# Altium schematic sheet Copy of DAP-Peripherals-4.SchDoc
size C; SheetNumber: 4; SheetTotal: 4
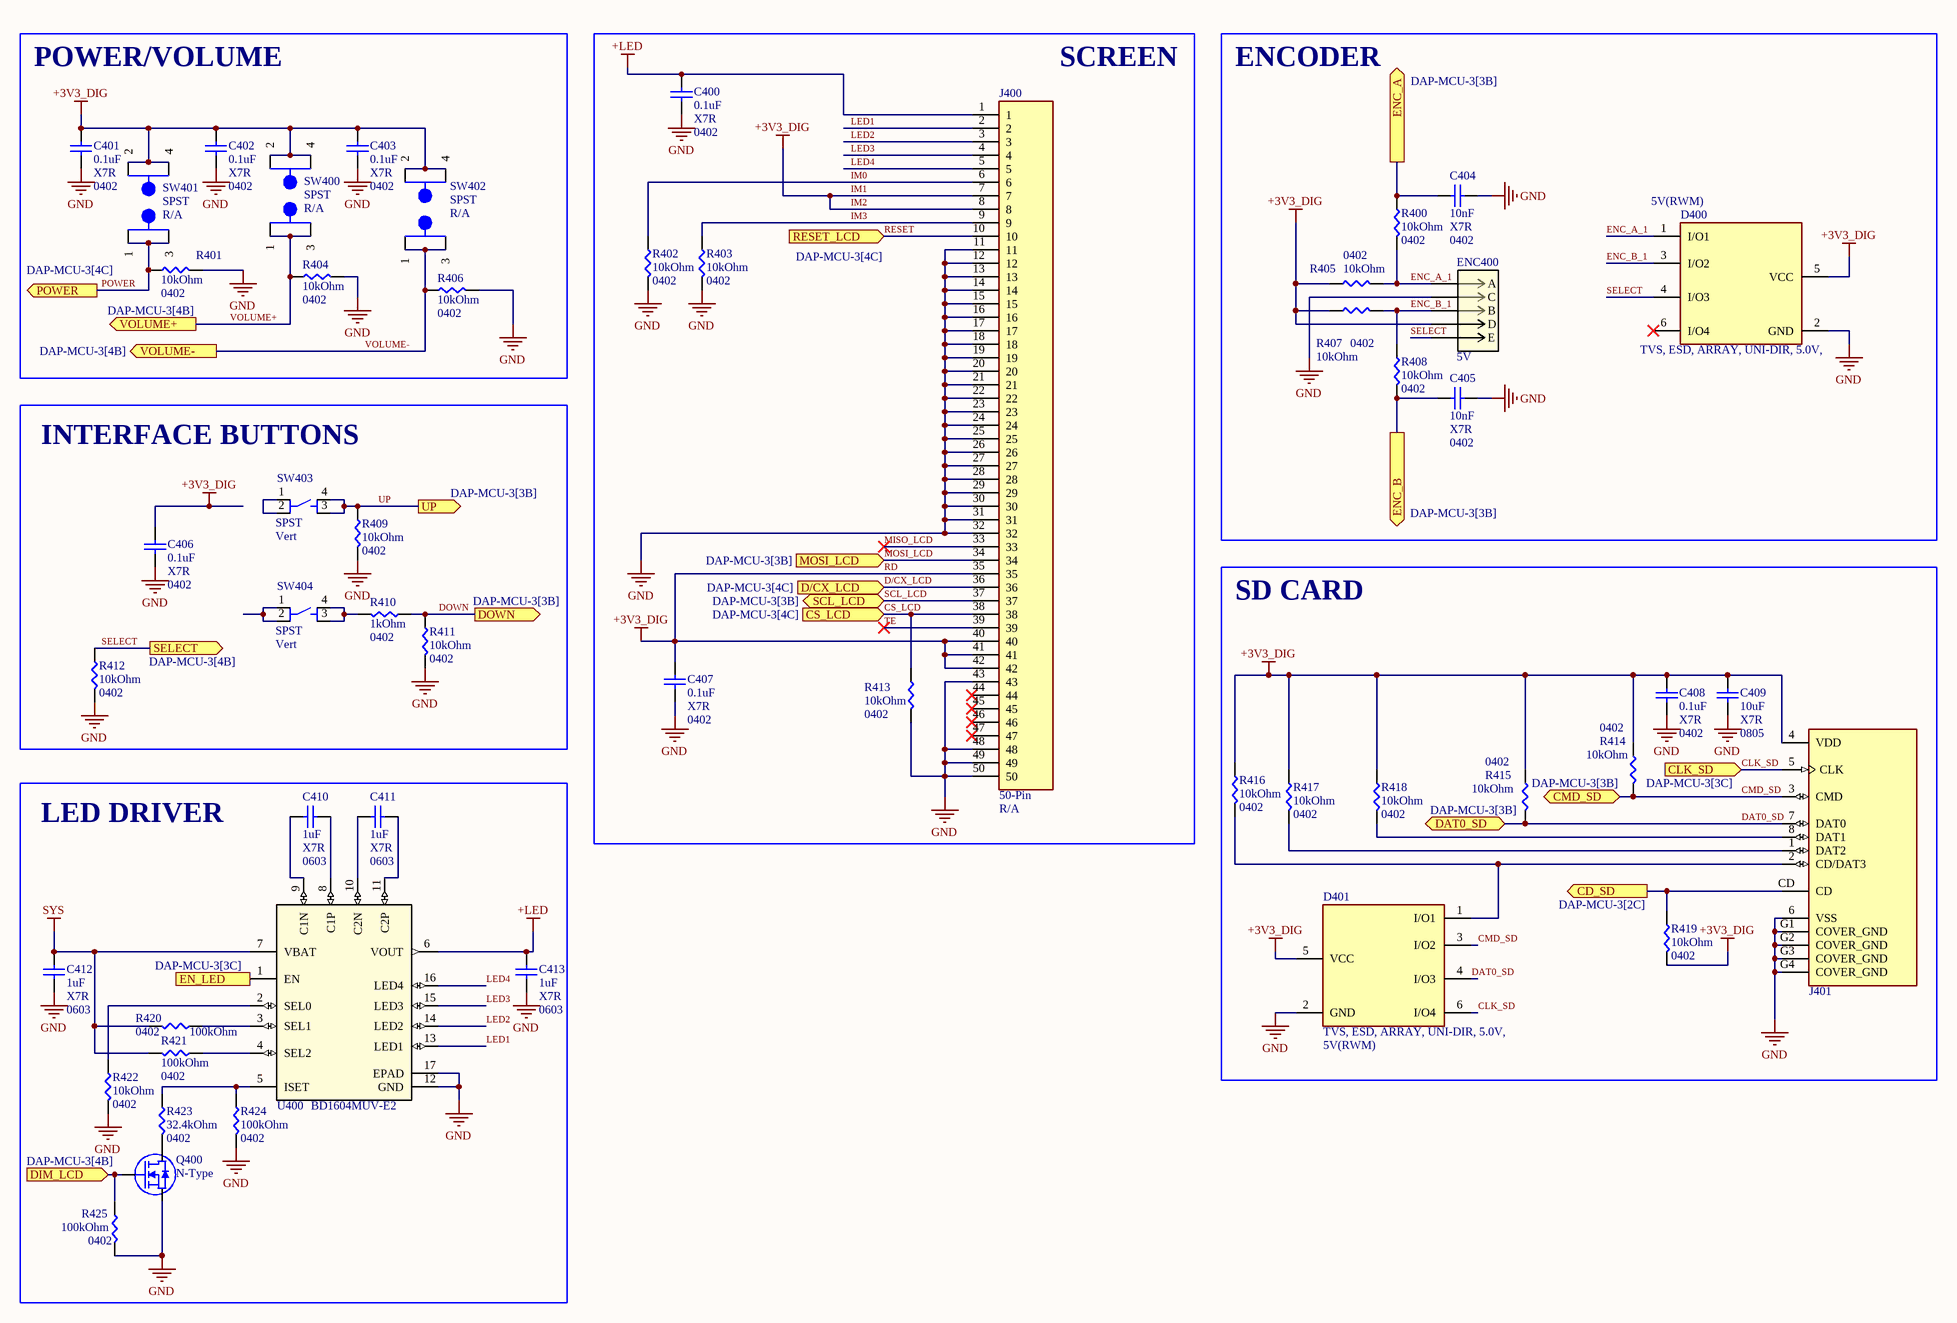
[diagram p0: Copy of DAP-Peripherals-4.SchDoc]

## Parts
C400  <Value>: 0.1uF  <Spec>: X7R  <Footprint>: 0402  [CAPC1005X60N]  (hidden comment: CAP CER 0.1UF 50V X7R 0402)
C401  <Value>: 0.1uF  <Spec>: X7R  <Footprint>: 0402  [CAPC1005X60N]  (hidden comment: CAP CER 0.1UF 50V X7R 0402)
C402  <Value>: 0.1uF  <Spec>: X7R  <Footprint>: 0402  [CAPC1005X60N]  (hidden comment: CAP CER 0.1UF 50V X7R 0402)
C403  <Value>: 0.1uF  <Spec>: X7R  <Footprint>: 0402  [CAPC1005X60N]  (hidden comment: CAP CER 0.1UF 50V X7R 0402)
C404  <Value>: 10nF  <Spec>: X7R  <Footprint>: 0402  [CAPC1005X55N]  (hidden comment: CAP CER 10000PF 16V X7R 0402)
C405  <Value>: 10nF  <Spec>: X7R  <Footprint>: 0402  [CAPC1005X55N]  (hidden comment: CAP CER 10000PF 16V X7R 0402)
C406  <Value>: 0.1uF  <Spec>: X7R  <Footprint>: 0402  [CAPC1005X60N]  (hidden comment: CAP CER 0.1UF 50V X7R 0402)
C407  <Value>: 0.1uF  <Spec>: X7R  <Footprint>: 0402  [CAPC1005X60N]  (hidden comment: CAP CER 0.1UF 50V X7R 0402)
C408  <Value>: 0.1uF  <Spec>: X7R  <Footprint>: 0402  [CAPC1005X60N]  (hidden comment: CAP CER 0.1UF 50V X7R 0402)
C409  <Value>: 10uF  <Spec>: X7R  <Footprint>: 0805  [CAPC2012X140N]  (hidden comment: CAP CER 10UF 10V X7R 0805)
C410  <Value>: 1uF  <Spec>: X7R  <Footprint>: 0603  [CAPC1608X100N]  (hidden comment: CAP CER 1UF 25V X7R 0603)
C411  <Value>: 1uF  <Spec>: X7R  <Footprint>: 0603  [CAPC1608X100N]  (hidden comment: CAP CER 1UF 25V X7R 0603)
C412  <Value>: 1uF  <Spec>: X7R  <Footprint>: 0603  [CAPC1608X100N]  (hidden comment: CAP CER 1UF 25V X7R 0603)
C413  <Value>: 1uF  <Spec>: X7R  <Footprint>: 0603  [CAPC1608X100N]  (hidden comment: CAP CER 1UF 25V X7R 0603)
D400  TVS, ESD, ARRAY, UNI-DIR, 5.0V,  <Value>: 5V(RWM)  [TVS_ARR_4UNI_FP]
D401  TVS, ESD, ARRAY, UNI-DIR, 5.0V,  <Value>: 5V(RWM)  [TVS_ARR_4UNI_FP]
ENC400  <Value>: 5V  [CONN03_EC12D1564404]  (hidden comment: ENCODER INCREM QUAD VERT PC PIN)
J400  <Value>: 50-Pin  <Footprint>: R/A  [AMPHENOL_F32D-1A7Y1-21050]  (hidden comment: CONN FFC BOTTOM 50POS 0.5MM R/A)
J401  CONN MICROSD CARD R/A SMD  [CUI_MSD-1-A]  (value not drawn)
Q400  <Value>: N-Type  [SOT-23_MCC]  (hidden comment: MOSFET N-CH 60V 115MA SOT23)
R400  <Value>: 10kOhm  <Footprint>: 0402  [RESC1005X40N]  (hidden comment: RES SMD 10K OHM 1% 1/16W 0402)
R401  <Value>: 10kOhm  <Footprint>: 0402  [RESC1005X40N]  (hidden comment: RES SMD 10K OHM 1% 1/16W 0402)
R402  <Value>: 10kOhm  <Footprint>: 0402  [RESC1005X40N]  (hidden comment: RES SMD 10K OHM 1% 1/16W 0402)
R403  <Value>: 10kOhm  <Footprint>: 0402  [RESC1005X40N]  (hidden comment: RES SMD 10K OHM 1% 1/16W 0402)
R404  <Value>: 10kOhm  <Footprint>: 0402  [RESC1005X40N]  (hidden comment: RES SMD 10K OHM 1% 1/16W 0402)
R405  <Value>: 10kOhm  <Footprint>: 0402  [RESC1005X40N]  (hidden comment: RES SMD 10K OHM 1% 1/16W 0402)
R406  <Value>: 10kOhm  <Footprint>: 0402  [RESC1005X40N]  (hidden comment: RES SMD 10K OHM 1% 1/16W 0402)
R407  <Value>: 10kOhm  <Footprint>: 0402  [RESC1005X40N]  (hidden comment: RES SMD 10K OHM 1% 1/16W 0402)
R408  <Value>: 10kOhm  <Footprint>: 0402  [RESC1005X40N]  (hidden comment: RES SMD 10K OHM 1% 1/16W 0402)
R409  <Value>: 10kOhm  <Footprint>: 0402  [RESC1005X40N]  (hidden comment: RES SMD 10K OHM 1% 1/16W 0402)
R410  <Value>: 1kOhm  <Footprint>: 0402  [RESC1005X40N]  (hidden comment: RES SMD 1K OHM 0.1% 1/16W 0402)
R411  <Value>: 10kOhm  <Footprint>: 0402  [RESC1005X40N]  (hidden comment: RES SMD 10K OHM 1% 1/16W 0402)
R412  <Value>: 10kOhm  <Footprint>: 0402  [RESC1005X40N]  (hidden comment: RES SMD 10K OHM 1% 1/16W 0402)
R413  <Value>: 10kOhm  <Footprint>: 0402  [RESC1005X40N]  (hidden comment: RES SMD 10K OHM 1% 1/16W 0402)
R414  <Value>: 10kOhm  <Footprint>: 0402  [RESC1005X40N]  (hidden comment: RES SMD 10K OHM 1% 1/16W 0402)
R415  <Value>: 10kOhm  <Footprint>: 0402  [RESC1005X40N]  (hidden comment: RES SMD 10K OHM 1% 1/16W 0402)
R416  <Value>: 10kOhm  <Footprint>: 0402  [RESC1005X40N]  (hidden comment: RES SMD 10K OHM 1% 1/16W 0402)
R417  <Value>: 10kOhm  <Footprint>: 0402  [RESC1005X40N]  (hidden comment: RES SMD 10K OHM 1% 1/16W 0402)
R418  <Value>: 10kOhm  <Footprint>: 0402  [RESC1005X40N]  (hidden comment: RES SMD 10K OHM 1% 1/16W 0402)
R419  <Value>: 10kOhm  <Footprint>: 0402  [RESC1005X40N]  (hidden comment: RES SMD 10K OHM 1% 1/16W 0402)
R420  <Value>: 100kOhm  <Footprint>: 0402  [RESC1005X40N]  (hidden comment: RES SMD 100K OHM 0.1% 1/16W 0402)
R421  <Value>: 100kOhm  <Footprint>: 0402  [RESC1005X40N]  (hidden comment: RES SMD 100K OHM 0.1% 1/16W 0402)
R422  <Value>: 10kOhm  <Footprint>: 0402  [RESC1005X40N]  (hidden comment: RES SMD 10K OHM 1% 1/16W 0402)
R423  <Value>: 32.4kOhm  <Footprint>: 0402  [RESC1005X40N]  (hidden comment: RES 32.4K OHM 1% 1/16W 0402)
R424  <Value>: 100kOhm  <Footprint>: 0402  [RESC1005X40N]  (hidden comment: RES SMD 100K OHM 0.1% 1/16W 0402)
R425  <Value>: 100kOhm  <Footprint>: 0402  [RESC1005X40N]  (hidden comment: RES SMD 100K OHM 0.1% 1/16W 0402)
SW400  <Value>: SPST  <Footprint>: R/A  [SW_TL1014BF220QG]  (hidden comment: SWITCH TACTILE SPST-NO 0.05A 12V)
SW401  <Value>: SPST  <Footprint>: R/A  [SW_TL1014BF220QG]  (hidden comment: SWITCH TACTILE SPST-NO 0.05A 12V)
SW402  <Value>: SPST  <Footprint>: R/A  [SW_TL1014BF220QG]  (hidden comment: SWITCH TACTILE SPST-NO 0.05A 12V)
SW403  <Value>: SPST  <Footprint>: Vert  [SW_PTS810_SJM_250_SMTR_LFS]  (hidden comment: SWITCH TACTILE SPST-NO 0.05A 16V)
SW404  <Value>: SPST  <Footprint>: Vert  [SW_PTS810_SJM_250_SMTR_LFS]  (hidden comment: SWITCH TACTILE SPST-NO 0.05A 16V)
U400  IC LED DRIVER RGLTR 30MA 16VQFN  [VQFN016V3030_ROM]  (value not drawn)

## Blocks framed on the sheet
POWER/VOLUME: C401-C403 R401 R404 R406 SW400-SW402
SCREEN: C400 C407 J400 R402 R403 R413
ENCODER: C404 C405 D400 ENC400 R400 R405 R407 R408
INTERFACE BUTTONS: C406 R409-R412 SW403 SW404
SD CARD: C408 C409 D401 J401 R414-R419
LED DRIVER: C410-C413 Q400 R420-R425 U400

## Ports
CD_SD (out, see DAP-MCU-3[2C]), CLK_SD (in, see DAP-MCU-3[3C]), CMD_SD (bidir, see DAP-MCU-3[3B]), CS_LCD (in, see DAP-MCU-3[4C]), D/CX_LCD (in, see DAP-MCU-3[4C]), DAT0_SD (bidir, see DAP-MCU-3[3B]), DIM_LCD (in, see DAP-MCU-3[4B]), DOWN (out, see DAP-MCU-3[3B]), EN_LED (in, see DAP-MCU-3[3C]), ENC_A (out, see DAP-MCU-3[3B]), ENC_B (out, see DAP-MCU-3[3B]), MOSI_LCD (in, see DAP-MCU-3[3B]), POWER (out, see DAP-MCU-3[4C]), RESET_LCD (in, see DAP-MCU-3[4C]), SCL_LCD (bidir, see DAP-MCU-3[3B]), SELECT (out, see DAP-MCU-3[4B]), UP (out, see DAP-MCU-3[3B]), VOLUME+ (out, see DAP-MCU-3[4B]), VOLUME- (out, see DAP-MCU-3[4B])

## Nets
+LED: C400.2 C413.2 J400.1 U400.6(VOUT)
GND: C400.1 C401.1 C402.1 C403.1 C404.1 C405.1 C406.1 C407.1 C408.1 C409.1 C412.1 C413.1 D400.2(GND) D401.2(GND) ENC400.2(C) J400.11 J400.12 J400.13 J400.14 J400.15 J400.16 J400.17 J400.18 J400.19 J400.20 J400.21 J400.22 J400.23 J400.24 J400.25 J400.26 J400.27 J400.28 J400.29 J400.30 J400.31 J400.32 J400.43 J400.48 J400.49 J400.50 J401.6(VSS) J401.G1(COVER_GND) J401.G2(COVER_GND) J401.G3(COVER_GND) J401.G4(COVER_GND) Q400.2(S) R401.1 R402.1 R403.1 R404.1 R406.1 R409.1 R411.1 R412.1 R413.1 R422.1 R424.1 R425.1 U400.12(GND) U400.17(EPAD)
IM1: C401.2 C402.2 C403.2 C406.2 C407.2 C408.2 C409.2 D400.5(VCC) D401.5(VCC) ENC400.4(D) J400.7 J400.8 J400.35 J400.40 J400.41 J400.42 J401.4(VDD) R405.2 R407.2 R414.2 R415.2 R416.2 R417.2 R418.2 R419.1  [also labelled +3V3_DIG, IM2, RD]
SYS: C412.2 R420.1 R421.1 U400.7(VBAT)
CD_SD: J401.CD R419.2 ; port CD_SD
CLK_SD: D401.6(I/O4) J401.5(CLK) ; port CLK_SD
CMD_SD: D401.3(I/O2) J401.3(CMD) R414.1 ; port CMD_SD
CS_LCD: J400.38 R413.2 ; port CS_LCD
D/CX_LCD: J400.36 ; port D/CX_LCD
DAT0_SD: D401.4(I/O3) J401.7(DAT0) R415.1 ; port DAT0_SD
DIM_LCD: Q400.1(G) R425.2 ; port DIM_LCD
DOWN: R410.2 R411.2 ; port DOWN
EN_LED: U400.1(EN) ; port EN_LED
ENC_A: C404.2 R400.2 ; port ENC_A
ENC_A_1: D400.1(I/O1) ENC400.1(A) R400.1 R405.1
ENC_B: C405.2 R408.1 ; port ENC_B
ENC_B_1: D400.3(I/O2) ENC400.3(B) R407.1 R408.2
IM0: J400.6 R402.2
IM3: J400.9 R403.2
LED1: J400.2 U400.13(LED1)
LED2: J400.3 U400.14(LED2)
LED3: J400.4 U400.15(LED3)
LED4: J400.5 U400.16(LED4)
MISO_LCD: J400.33
MOSI_LCD: J400.34 ; port MOSI_LCD
POWER: R401.2 ; port POWER
RESET: J400.10 ; port RESET_LCD
SCL_LCD: J400.37 ; port SCL_LCD
SELECT: D400.4(I/O3) ENC400.5(E) R412.2 ; port SELECT
TE: J400.39
UP: R409.2 SW403.3 SW403.4 ; port UP
VOLUME+: R404.2 ; port VOLUME+
VOLUME-: R406.2 ; port VOLUME-
NetC410_1: C410.1 U400.8(C1P)
NetC410_2: C410.2 U400.9(C1N)
NetC411_1: C411.1 U400.11(C2P)
NetC411_2: C411.2 U400.10(C2N)
NetD401_1: D401.1(I/O1) J401.2(CD/DAT3) R416.1
NetJ401_1: J401.1(DAT2) R417.1
NetJ401_8: J401.8(DAT1) R418.1
NetQ400_3: Q400.3(D) R423.1
NetR410_1: R410.1 SW404.3 SW404.4
NetR420_2: R420.2 U400.3(SEL1)
NetR421_2: R421.2 U400.4(SEL2)
NetR422_2: R422.2 U400.2(SEL0)
NetR423_2: R423.2 R424.2 U400.5(ISET)
NetSW403_1: SW403.1 SW403.2
NetSW404_1: SW404.1 SW404.2

Not connected (* = marked no-connect by the designer): D400 6(I/O4)*; J400 44* 45* 46* 47*; SW400 1 2 3 4; SW401 1 2 3 4; SW402 1 2 3 4

## Library data of the parts
C400-C403 C406-C408 = #1-080: Manufacturer 1: Murata Electronics; Manufacturer Part Number 1: GCM155R71H104KE02D; AL-PN: #1-080; SubType: Ceramic; <Tolerance>: 0.1; <Termination>: SMD; Creator Project: DAP; Type: Standard; Lead Time: 21 Weeks; PartType: Capacitor; <Rating>: 50V; Status: Verified; Supplier 1: Digikey; Supplier Label: 0.1 µF ±10% 50V Ceramic Capacitor X7R 0402 (1005 Metric); Supplier Part Number 1: 490-10672-1-ND
C404 C405 = #1-040: Manufacturer 1: YAGEO; Manufacturer Part Number 1: CC0402KRX7R7BB103; AL-PN: #1-040; SubType: Ceramic; <Tolerance>: 0.1; <Termination>: SMD; Creator Project: aRTy; Type: Standard; Lead Time: 21 Weeks; PartType: Capacitor; <Rating>: 16V; Status: Verified; Supplier 1: Digikey; Supplier Label: 10000 pF ±10% 16V Ceramic Capacitor X7R 0402 (1005 Metric); Supplier Part Number 1: 311-1042-2-ND
C409 = #1-081: Manufacturer 1: Murata Electronics; Manufacturer Part Number 1: GCM21BR71A106KE22K; AL-PN: #1-081; SubType: Ceramic; <Tolerance>: 0.1; <Termination>: SMD; Creator Project: DAP; Type: Standard; Lead Time: 21 Weeks; PartType: Capacitor; <Rating>: 10V; Status: Verified; Supplier 1: Digikey; Supplier Label: 10 µF ±10% 10V Ceramic Capacitor X7R 0805 (2012 Metric); Supplier Part Number 1: 490-14531-1-ND
C410-C413 = #1-132: Manufacturer 1: Murata Electronics; Manufacturer Part Number 1: GCM188R71E105KA64D; AL-PN: #1-132; SubType: Ceramic; <Tolerance>: 0.1; <Termination>: SMD; Creator Project: DAP; Type: Standard; Lead Time: 21 Weeks; PartType: Capacitor; <Rating>: 25V; Status: Verified; Supplier 1: Digikey; Supplier Label: 1 µF ±10% 25V Ceramic Capacitor X7R 0603 (1608 Metric); Supplier Part Number 1: 490-10673-1-ND
D400 D401 = #1-127: Manufacturer 1: Good-Ark Semiconductor; Manufacturer Part Number 1: GSER5U007; AL-PN: #1-127; <Rating>: 12A; <Termination>: SMD; Creator Project: DAP; Lead Time: 16 Weeks; Type: Standard; PartType: Diode; Status: Verified; SubType: TVS; Supplier 1: Digikey; Supplier Label: 25V Clamp 12A (8/20µs) Ipp Tvs Diode Surface Mount SOT-23-6L; Supplier Part Number 1: 4786-GSER5U007CT-ND
ENC400 = #1-125: Manufacturer 1: Alps Alpine; Manufacturer Part Number 1: EC12D1564404; AL-PN: #1-125; SubType: Quadrature; <Rating>: 1mA; <Termination>: Thru; Creator Project: DAP; Lead Time: 20 Weeks; PartType: Encoder; Status: Verified; Supplier 1: Digikey; Supplier Label: Rotary Encoder Incremental 15 Quadrature (Incremental) Vertical; Supplier Part Number 1: 4809-EC12D1564404-ND; Type: Standard
J400 = #1-117: Manufacturer 1: Amphenol ICC; MF: Amphenol ICC (FCI); AL-PN: #1-117; <Termination>: SMD; Creator Project: DAP; Lead Time: 13 Weeks; SnapEDA_Link: https://www.snapeda.com/parts/F32D-1A7Y1-21050/Amphenol+FCI/view-part/?ref=snap; Package: None; Value: *; MP: F32D-1A7Y1-21050; Check_prices: https://www.snapeda.com/parts/F32D-1A7Y1-21050/Amphenol+FCI/view-part/?ref=eda; PartType: Connector; SubType: FFC; Status: Verified; Supplier 1: Digikey; Supplier Label: 50 Position FFC, FPC Connector Contacts, Top and Bottom 0.020" (0.50mm) Surface Mount, Right Angle; Supplier Part Number 1: 609-F32D-1A7Y1-21050CT-ND; Type: Standard; Manufacturer Part Number 1: F32D-1A7Y1-21050
J401 = #1-126: MF: Same Sky; AL-PN: #1-126; SubType: Micro-SD; Creator Project: DAP; Lead Time: 8 Weeks; SnapEDA_Link: https://www.snapeda.com/parts/MSD-1-A/Same+Sky/view-part/?ref=snap; Package: None; Value: *; MP: MSD-1-A; Check_prices: https://www.snapeda.com/parts/MSD-1-A/Same+Sky/view-part/?ref=eda; PartType: Connector; <Termination>: SMD; Status: Verified; Supplier 1: Digikey; Supplier Label: 9 (8 + 1) Position Card Connector microSD™ Surface Mount, Right Angle Gold; Supplier Part Number 1: 2223-MSD-1-ACT-ND; Type: Standard; Manufacturer 1: Same Sky; Manufacturer Part Number 1: MSD-1-A
Q400 = #1-130: Manufacturer 1: MCC; MF: Micro Commercial; MP: 2N7002-TP; AL-PN: #1-130; <Rating>: 2.5Vgs; <Termination>: SMD; Creator Project: DAP; Type: Standard; SnapEDA_Link: https://www.snapeda.com/parts/2N7002-TP/Micro+Commercial/view-part/?ref=snap; Package: TO-236 MCC; Value: *; Check_prices: https://www.snapeda.com/parts/2N7002-TP/Micro+Commercial/view-part/?ref=eda; PartType: Transistor; SubType: MOSFET; Status: Verified; Supplier 1: Digikey; Supplier Label: N-Channel 60 V 115mA (Ta) 1.08W Surface Mount SOT-23; Supplier Part Number 1: 2N7002-TPMSCT-ND; Manufacturer Part Number 1: 2N7002-TP; Lead Time: N/A
R400-R409 R411-R419 R422 = #1-134: Manufacturer 1: YAGEO; Manufacturer Part Number 1: AC0402FR-0710KL; AL-PN: #1-134; <Tolerance>: 0.01; Creator Project: DAP; Lead Time: 22 Weeks; PartType: Resistor; <Termination>: SMD; Status: Verified; Supplier 1: Digikey; Supplier Label: 10 kOhms ±1% 0.063W, 1/16W Chip Resistor 0402 (1005 Metric) Automotive AEC-Q200, Moisture Resistant Thick Film; Supplier Part Number 1: YAG3436CT-ND; Type: Standard
R410 = #1-043: Manufacturer 1: YAGEO; Manufacturer Part Number 1: RT0402BRD071KL; AL-PN: #1-043; <Tolerance>: 0.001; Creator Project: aRTy; Lead Time: 20 Weeks; PartType: Resistor; <Rating>: 1/16W; <Termination>: SMD; Status: Verified; Supplier 1: Digikey; Supplier Label: 1 kOhms ±0.1% 0.063W, 1/16W Chip Resistor 0402 (1005 Metric) Thin Film; Supplier Part Number 1: YAG1386TR-ND; Type: Standard
R420 R421 R424 R425 = #1-131: Manufacturer 1: YAGEO; Manufacturer Part Number 1: RT0402BRD07100KL; AL-PN: #1-131; <Tolerance>: 0.01; Creator Project: DAP; Lead Time: 23 Weeks; PartType: Resistor; <Termination>: SMD; Status: Verified; Supplier 1: Digikey; Supplier Label: 100 kOhms ±0.1% 0.063W, 1/16W Chip Resistor 0402 (1005 Metric) Thin Film; Supplier Part Number 1: YAG1343CT-ND; Type: Standard
R423 = #1-133: Manufacturer 1: YAGEO; Manufacturer Part Number 1: RC0402FR-0732K4L; AL-PN: #1-133; <Tolerance>: 0.01; <Termination>: SMD; Creator Project: DAP; Lead Time: 22 Weeks; PartType: Resistor; Status: Verified; Supplier 1: Digikey; Supplier Label: 32.4 kOhms ±1% 0.063W, 1/16W Chip Resistor 0402 (1005 Metric) Moisture Resistant Thick Film; Supplier Part Number 1: YAG3119CT-ND; Type: Standard
SW400-SW402 = #1-114: Manufacturer 1: E-Switch; Manufacturer Part Number 1: TL1014BF220QG; AL-PN: #1-114; SubType: Tacticle; <Termination>: SMD; Creator Project: DAP; Lead Time: 7 Weeks; PartType: Switch; Status: Verified; Supplier 1: Digikey; Supplier Label: Tactile Switch SPST-NO Side Actuated Surface Mount, Right Angle; Supplier Part Number 1: 141-TL1014BF220QGCT-ND; Type: Standard
SW403 SW404 = #1-115: Manufacturer Part Number 1: PTS810SJM250SMTR LFS; MF: C&K; MP: PTS810 SJM 250 SMTR LFS; AL-PN: #1-115; SubType: Tacticle; <Termination>: SMD; Creator Project: DAP; Lead Time: 16 Weeks; SnapEDA_Link: https://www.snapeda.com/parts/PTS810%20SJM%20250%20SMTR%20LFS/C%2526K/view-part/?ref=snap; Package: None; Value: *; Check_prices: https://www.snapeda.com/parts/PTS810%20SJM%20250%20SMTR%20LFS/C%2526K/view-part/?ref=eda; PartType: Switch; Status: Verified; Supplier 1: Digikey; Supplier Label: Tactile Switch SPST-NO Top Actuated Surface Mount; Supplier Part Number 1: CKN10502CT-ND; Type: Standard; Manufacturer 1: C&K
U400 = #1-128: Manufacturer_Name: ROHM Semiconductor; AL-PN: #1-128; <Termination>: SMD; Creator Project: DAP; Lead Time: 12 Weeks; Copyright: Copyright (C) 2025 Ultra Librarian. All rights reserved.; Manufacturer_Part_Number: BD1604MUV-E2; RefDes: RefDes; Type: Standard; PartType: IC; SubType: LED Driver; Status: Verified; Supplier 1: Digikey; Supplier Label: LED Driver IC 4 Output DC DC Regulator Switched Capacitor (Charge Pump) Dimming 30mA VQFN016V3030; Supplier Part Number 1: BD1604MUV-E2CT-ND; Manufacturer 1: Rohm Semiconductor; Manufacturer Part Number 1: BD1604MUV-E2